# Altium schematic sheet input.SchDoc
size A
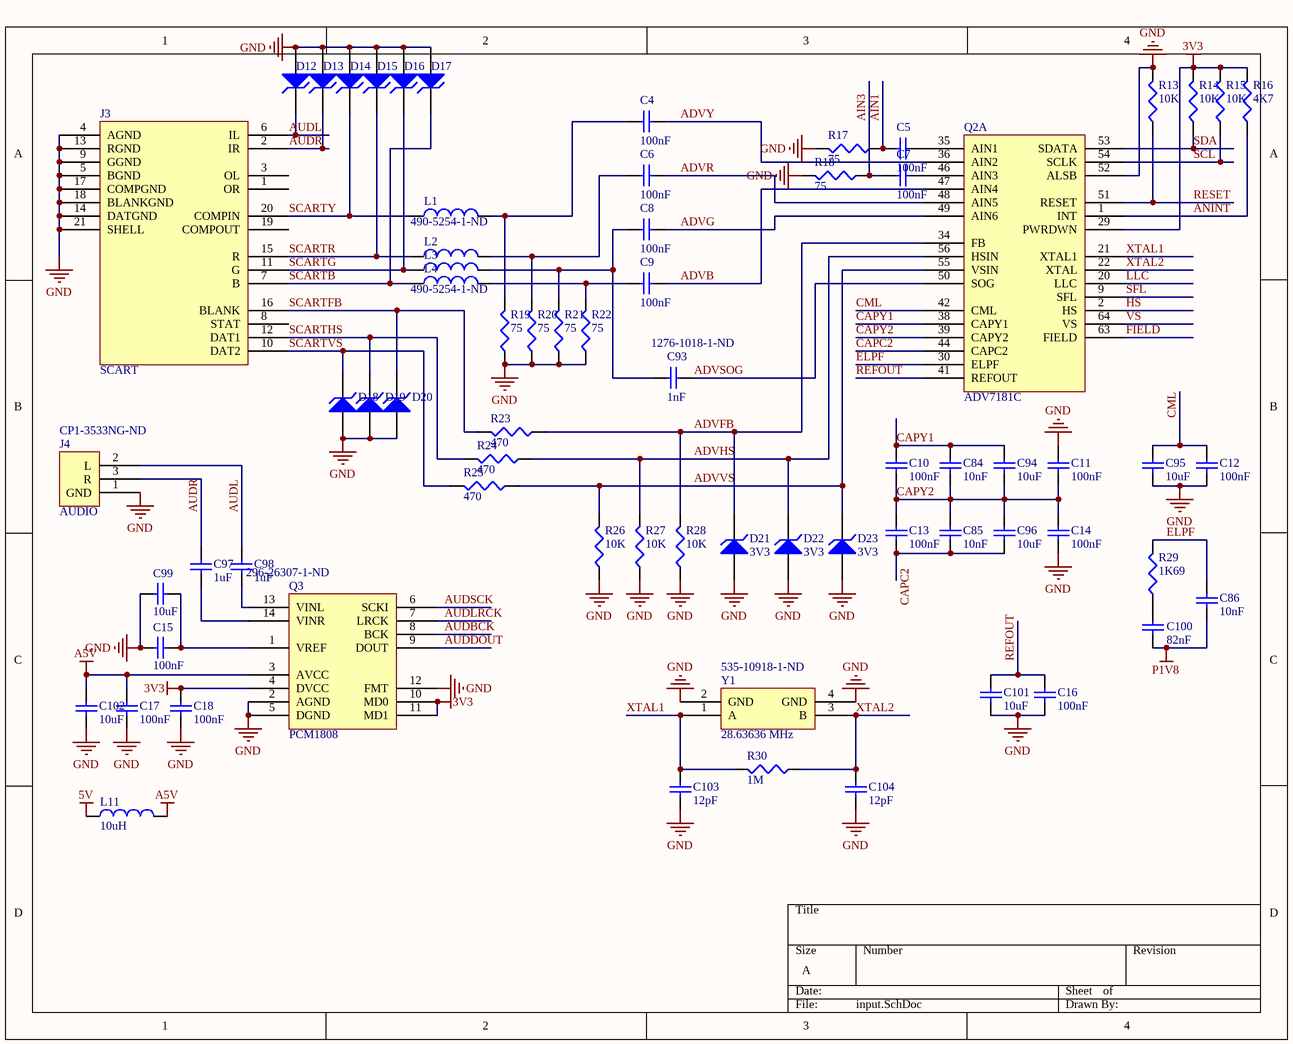
[diagram p0: input.SchDoc]

## Parts
C4  value 100nF  [CAPC1005X06L]  (hidden comment: Cap)
C5  value 100nF  [CAPC1005X06L]  (hidden comment: Cap)
C6  value 100nF  [CAPC1005X06L]  (hidden comment: Cap)
C7  value 100nF  [CAPC1005X06L]  (hidden comment: Cap)
C8  value 100nF  [CAPC1005X06L]  (hidden comment: Cap)
C9  value 100nF  [CAPC1005X06L]  (hidden comment: Cap)
C10  value 100nF  [CAPC1005X06L]  (hidden comment: Cap)
C11  value 100nF  [CAPC1005X06L]  (hidden comment: Cap)
C12  value 100nF  [CAPC1005X06L]  (hidden comment: Cap)
C13  value 100nF  [CAPC1005X06L]  (hidden comment: Cap)
C14  value 100nF  [CAPC1005X06L]  (hidden comment: Cap)
C15  value 100nF  [CAPC1005X06L]  (hidden comment: Cap)
C16  value 100nF  [CAPC1005X06L]  (hidden comment: Cap)
C17  value 100nF  [CAPC1005X06L]  (hidden comment: Cap)
C18  value 100nF  [CAPC1005X06L]  (hidden comment: Cap)
C84  value 10nF  [CAPC1005X06L]  (hidden comment: Cap)
C85  value 10nF  [CAPC1005X06L]  (hidden comment: Cap)
C86  value 10nF  [CAPC1005X06L]  (hidden comment: Cap)
C93  value 1nF  Supplier Part Number 1: 1276-1018-1-ND  [CAPC1608X90N]  (hidden comment: Cap)
C94  value 10uF  [CAPC1608X90N]  (hidden comment: Cap)
C95  value 10uF  [CAPC1608X90N]  (hidden comment: Cap)
C96  value 10uF  [CAPC1608X90N]  (hidden comment: Cap)
C97  value 1uF  [CAPC1608X90N]  (hidden comment: Cap)
C98  value 1uF  [CAPC1608X90N]  (hidden comment: Cap)
C99  value 10uF  [CAPC1608X90N]  (hidden comment: Cap)
C100  value 82nF  [CAPC1608X90N]  (hidden comment: Cap)
C101  value 10uF  [CAPC1608X90N]  (hidden comment: Cap)
C102  value 10uF  [CAPC1608X90N]  (hidden comment: Cap)
C103  value 12pF  [CAPC1608X90N]  (hidden comment: Cap)
C104  value 12pF  [CAPC1608X90N]  (hidden comment: Cap)
D12  EZAEG2A  [CAPC1005X55N]  (value not drawn)
D13  EZAEG2A  [CAPC1005X55N]  (value not drawn)
D14  EZAEG2A  [CAPC1005X55N]  (value not drawn)
D15  EZAEG2A  [CAPC1005X55N]  (value not drawn)
D16  EZAEG2A  [CAPC1005X55N]  (value not drawn)
D17  EZAEG2A  [CAPC1005X55N]  (value not drawn)
D18  EZAEG2A  [CAPC1005X55N]  (value not drawn)
D19  EZAEG2A  [CAPC1005X55N]  (value not drawn)
D20  EZAEG2A  [CAPC1005X55N]  (value not drawn)
D21  3V3  [SOD323]
D22  3V3  [SOD323]
D23  3V3  [SOD323]
J3  SCART  [SCART]
J4  AUDIO  Supplier Part Number 1: CP1-3533NG-ND  [SJ1-3533NG]
L1  Supplier Part Number 1: 490-5254-1-ND  [CAPC1608X90N]
L2  (no value)  [CAPC1608X90N]
L3  (no value)  [CAPC1608X90N]
L4  Supplier Part Number 1: 490-5254-1-ND  [CAPC1608X90N]
L11  value 10uH  [CAPC3225X220N]  (hidden comment: LBC3225T100KR)
Q2  ADV7181C  [TSQFP50P1200X1200X145-64N]  (part A of 3)
Q3  PCM1808  Supplier Part Number 1: 296-26307-1-ND  [TSOP65P640X120-14N]
R13  value 10K  [CAPC1608X90N]  (hidden comment: Res3)
R14  value 10K  [CAPC1608X90N]  (hidden comment: Res3)
R15  value 10K  [CAPC1608X90N]  (hidden comment: Res3)
R16  value 4K7  [CAPC1608X90N]  (hidden comment: Res3)
R17  value 75  [CAPC1608X90N]  (hidden comment: Res3)
R18  value 75  [CAPC1608X90N]  (hidden comment: Res3)
R19  value 75  [CAPC1608X90N]  (hidden comment: Res3)
R20  value 75  [CAPC1608X90N]  (hidden comment: Res3)
R21  value 75  [CAPC1608X90N]  (hidden comment: Res3)
R22  value 75  [CAPC1608X90N]  (hidden comment: Res3)
R23  value 470  [CAPC2012X135N]  (hidden comment: Res3)
R24  value 470  [CAPC2012X135N]  (hidden comment: Res3)
R25  value 470  [CAPC2012X135N]  (hidden comment: Res3)
R26  value 10K  [CAPC1608X90N]  (hidden comment: Res3)
R27  value 10K  [CAPC1608X90N]  (hidden comment: Res3)
R28  value 10K  [CAPC1608X90N]  (hidden comment: Res3)
R29  value 1K69  [CAPC1608X90N]  (hidden comment: Res3)
R30  value 1M  [CAPC1608X90N]  (hidden comment: Res3)
Y1  28.63636 MHz  Supplier Part Number 1: 535-10918-1-ND  [ABM8G]

## Nets
3V3: C18.1 Q2.29(PWRDWN) Q3.4(DVCC) Q3.10(MD0) Q3.11(MD1) R14.2 R15.2 R16.2
5V: L11.1
A5V: C17.1 C102.1 L11.2 Q3.3(AVCC)
GND: C11.2 C12.1 C14.1 C15.2 C16.1 C17.2 C18.2 C95.1 C99.2 C101.1 C102.2 C103.1 C104.1 D12.1(A) D13.1(A) D14.1(A) D15.1(A) D16.1(A) D17.1(A) D18.1(A) D19.1(A) D20.1(A) D21.A D22.A D23.A J3.4(AGND) J3.5(BGND) J3.9(GGND) J3.13(RGND) J3.14(DATGND) J3.17(COMPGND) J3.18(BLANKGND) J3.21(SHELL) J4.1(GND) Q2.52(ALSB) Q3.2(AGND) Q3.5(DGND) Q3.12(FMT) R13.2 R17.2 R18.2 R19.1 R20.1 R21.1 R22.1 R26.1 R27.1 R28.1 Y1.2(GND) Y1.4(GND)
P1V8: C86.1 C100.1
ADVB: C9.2 Q2.47(AIN4)
ADVFB: D21.K Q2.34(FB) R23.1 R28.2
ADVG: C8.2 Q2.49(AIN6)
ADVHS: D22.K Q2.56(HSIN) R24.1 R27.2
ADVR: C6.2 Q2.48(AIN5)
ADVSOG: C93.2 Q2.50(SOG)
ADVVS: D23.K Q2.55(VSIN) R25.1 R26.2
ADVY: C4.2 Q2.36(AIN2)
AIN1: C5.1 R17.1
AIN3: C7.1 R18.1
ANINT: Q2.1(INT) R16.1
AUDBCK: Q3.8(BCK)
AUDDOUT: Q3.9(DOUT)
AUDL: C98.1 D12.2(K) J3.6(IL) J4.2(L)
AUDLRCK: Q3.7(LRCK)
AUDR: C97.1 D13.2(K) J3.2(IR) J4.3(R)
AUDSCK: Q3.6(SCKI)
CAPC2: C13.1 C85.1 C96.1 Q2.44(CAPC2)
CAPY1: C10.2 C84.2 C94.2 Q2.38(CAPY1)
CAPY2: C10.1 C11.1 C13.2 C14.2 C84.1 C85.2 C94.1 C96.2 Q2.39(CAPY2)
CML: C12.2 C95.2 Q2.42(CML)
ELPF: C86.2 Q2.30(ELPF) R29.2
FIELD: Q2.63(FIELD)
HS: Q2.2(HS)
LLC: Q2.20(LLC)
REFOUT: C16.2 C101.2 Q2.41(REFOUT)
RESET: Q2.51(RESET) R13.1
SCARTB: D17.2(K) J3.7(B) L4.1
SCARTFB: D20.2(K) J3.16(BLANK) R23.2
SCARTG: D16.2(K) J3.11(G) L3.1
SCARTHS: D19.2(K) J3.12(DAT1) R24.2
SCARTR: D15.2(K) J3.15(R) L2.1
SCARTVS: D18.2(K) J3.10(DAT2) R25.2
SCARTY: D14.2(K) J3.20(COMPIN) L1.1
SCL: Q2.54(SCLK) R15.1
SDA: Q2.53(SDATA) R14.1
SFL: Q2.9(SFL)
VS: Q2.64(VS)
XTAL1: C103.2 Q2.21(XTAL1) R30.2 Y1.1(A)
XTAL2: C104.2 Q2.22(XTAL) R30.1 Y1.3(B)
NetC4_1: C4.1 L1.2 R19.2
NetC5_2: C5.2 Q2.35(AIN1)
NetC6_1: C6.1 L2.2 R20.2
NetC7_2: C7.2 Q2.46(AIN3)
NetC8_1: C8.1 C93.1 L3.2 R21.2
NetC9_1: C9.1 L4.2 R22.2
NetC15_1: C15.1 C99.1 Q3.1(VREF)
NetC97_2: C97.2 Q3.14(VINR)
NetC98_2: C98.2 Q3.13(VINL)
NetC100_2: C100.2 R29.1

Not connected (* = marked no-connect by the designer): J3 1(OR) 3(OL) 8(STAT) 19(COMPOUT)

## Library data of the parts
C4-C18 C84-C86 C93-C104 = Cap: Capacitor; Published: 8-Jun-2000; LatestRevisionDate: 17-Jul-2002; LatestRevisionNote: Re-released for DXP Platform.; PackageReference: RAD-0.3; Publisher: Altium Limited; PackageDescription: Radial Cap, Thru-Hole; 2 Leads; 0.3 in Pin Spacing
  C84-C86: Supplier 1: Digi-Key; Supplier Part Number 1: 1276-1057-1-ND
  C93: Supplier 1: Digi-Key
  C94-C96 C99 C101 C102: Supplier 1: Digi-Key; Supplier Part Number 1: 1276-1119-1-ND
  C97 C98: Supplier 1: Digi-Key; Supplier Part Number 1: 1276-1024-1-ND
  C100: Supplier 1: Digi-Key; Supplier Part Number 1: 1276-2121-1-ND
  C103 C104: Supplier 1: Digi-Key; Supplier Part Number 1: 1276-2175-1-ND
D12-D23 = D Zener: Zener Diode; Published: 8-Jun-2000; LatestRevisionDate: 17-Jul-2002; LatestRevisionNote: Re-released for DXP Platform.; PackageReference: DIODE-0.7; Publisher: Altium Limited; PackageDescription: Diode, Thru-Hole; 2 Leads; 0.7 in Pin Spacing; Supplier 1: Digi-Key
  D12-D20: Supplier Part Number 1: P13571CT-ND
  D21-D23: Supplier Part Number 1: MM3Z3V3T1GOSCT-ND
L1-L4 L11 = Inductor: Code_IEC: 1005; Published: 8-Jun-2000; LatestRevisionDate: 29-May-2009; LatestRevisionNote: IPC-7351 Footprint Added.; PackageReference: 0402-A; Publisher: Altium Limited; PackageDescription: Chip Inductor; Code_JEITA: 0402; Supplier 1: Digi-Key
  L2 L3: Supplier Part Number 1: 490-5254-1-ND
  L11: Supplier Part Number 1: 587-2421-1-ND
R13-R30 = Res3: Resistor; Published: 8-Jun-2000; LatestRevisionDate: 29-May-2009; LatestRevisionNote: IPC-7351 Footprint Added.; PackageReference: J1-0603; Publisher: Altium Limited; PackageDescription: Chip Resistor; Supplier 1: Digi-Key
  R13-R15 R26-R28: Supplier Part Number 1: 1276-3485-1-ND
  R16: Supplier Part Number 1: 1276-5078-1-ND
  R17-R22: Supplier Part Number 1: 1276-3508-1-ND
  R23-R25: Supplier Part Number 1: P470ADCT-ND
  R29: Supplier Part Number 1: 1276-3491-1-ND
  R30: Supplier Part Number 1: 1276-5134-1-ND
Y1 = XTAL: Supplier 1: Digi-Key
J4 = AUDIO: Supplier 1: Digi-Key
Q2 = ADV7181C: Supplier 1: Digi-Key; Supplier Part Number 1: ADV7181CBSTZ-ND
Q3 = PCM1808: Supplier 1: Digi-Key